# EAGLE design prototype (EAGLE 9.1.3)
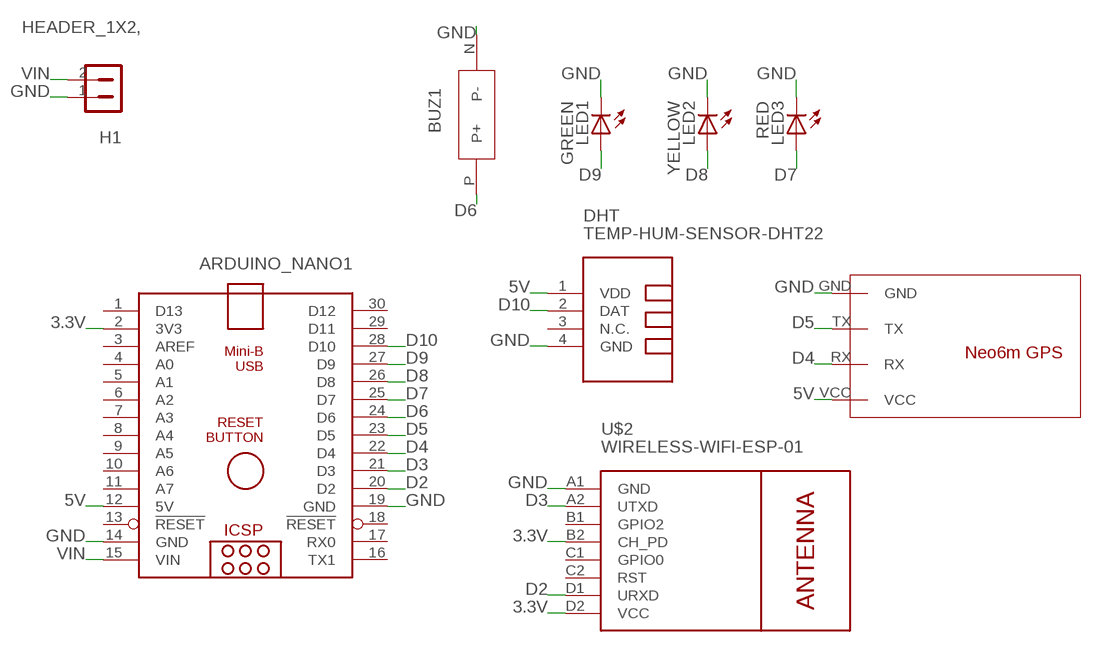
[diagram p0: schematic, sheet 1]

## Parts
ARDUINO_NANO1  ARDUINO_NANO  [ARDUINO_NANO]
BUZ1  BUZZER  [BUZZER]
DHT  TEMP-HUM-SENSOR-DHT22  [TEMP-HUM-SENSOR-DHT22]
H1  HEADER_1X2,  [MA_2X1]
LED1  GREEN  LED5MM  [LED5MM]
LED2  YELLOW  LED5MM  [LED5MM]
LED3  RED  LED5MM  [LED5MM]
U$1  NEO6M  [NEO6M]
U$2  WIRELESS-WIFI-ESP-01  [WIRELESS-WIFI-ESP-01]

## Nets
3.3V: ARDUINO_NANO1.2(3V3) U$2.B2(CH_PD) U$2.D2(VCC)
5V: ARDUINO_NANO1.12(5V) DHT.1(VDD) U$1.VCC
D2: ARDUINO_NANO1.20(D2) U$2.D1(URXD)
D3: ARDUINO_NANO1.21(D3) U$2.A2(UTXD)
D4: ARDUINO_NANO1.22(D4) U$1.RX
D5: ARDUINO_NANO1.23(D5) U$1.TX
D6: ARDUINO_NANO1.24(D6) BUZ1.P(P+)
D7: ARDUINO_NANO1.25(D7) LED3.A
D8: ARDUINO_NANO1.26(D8) LED2.A
D9: ARDUINO_NANO1.27(D9) LED1.A
D10: ARDUINO_NANO1.28(D10) DHT.2(DAT)
GND: ARDUINO_NANO1.14(GND) ARDUINO_NANO1.19(GND) BUZ1.N(P-) DHT.4(GND) H1.1 LED1.K(C) LED2.K(C) LED3.K(C) U$1.GND U$2.A1(GND)
VIN: ARDUINO_NANO1.15(VIN) H1.2
Unconnected: ARDUINO_NANO1.1(D13) ARDUINO_NANO1.3(AREF) ARDUINO_NANO1.4(A0) ARDUINO_NANO1.5(A1) ARDUINO_NANO1.6(A2) ARDUINO_NANO1.7(A3) ARDUINO_NANO1.8(A4) ARDUINO_NANO1.9(A5) ARDUINO_NANO1.10(A6) ARDUINO_NANO1.11(A7) ARDUINO_NANO1.13(!RESET) ARDUINO_NANO1.16(TX1) ARDUINO_NANO1.17(RX0) ARDUINO_NANO1.18(!RESET) ARDUINO_NANO1.29(D11) ARDUINO_NANO1.30(D12) DHT.3(N.C.) U$2.B1(GPIO2) U$2.C1(GPIO0) U$2.C2(RST)

## Library data of the parts
ARDUINO_NANO1 = ArduinoNanoV30:ARDUINO_NANO: Arduino Nano V3.0 Overview: The Arduino Nano is a small, complete, and breadboard-friendly board based on the ATmega328 (Arduino Nano 3.x) or ATmega168 (Arduino Nano 2.x). It has more or less the same functionality of the Arduino Duemilanove, but in a different package. It lacks only a DC power jack, and works with a Mini-B USB cable instead of a standard one. The Nano was designed and is being produced by Gravitech. Specifications: Microcontroller Atmel ATmega168 or ATmega328 Operating Voltage (logic level) 5 V Input Voltage (recommended) 7-12 V Input Voltage (limits) 6-20 V Digital I/O Pins 14 (of which 6 provide PWM output) Analog Input Pins 8 DC Current per I/O Pin 40 mA Flash Memory 16 KB (ATmega168) or 32 KB (ATmega328) of which 2 KB used by bootloader SRAM 1 KB (ATmega168) or 2 KB (ATmega328) EEPROM 512 bytes (ATmega168) or 1 KB (ATmega328) Clock Speed 16 MHz Dimensions 0.73" x 1.70" Length 45 mm Width 18 mm Weigth 5 g Power: The Arduino Nano can be powered via the Mini-B USB connection, 6-20V unregulated external power supply (pin 30), or 5V regulated external power supply (pin 27). The power source is automatically selected to the highest voltage source. Memory: The ATmega168 has 16 KB of flash memory for storing code (of which 2 KB is used for the bootloader); the ATmega328 has 32 KB, (also with 2 KB used for the bootloader). The ATmega168 has 1 KB of SRAM and 512 bytes of EEPROM (which can be read and written with the EEPROM library); the ATmega328 has 2 KB of SRAM and 1 KB of EEPROM. Input and Output: Each of the 14 digital pins on the Nano can be used as an input or output, using pinMode(), digitalWrite(), and digitalRead() functions. They operate at 5 volts. Each pin can provide or receive a maximum of 40 mA and has an internal pull-up resistor (disconnected by default) of 20-50 kOhms. In addition, some pins have specialized functions. Visit Arduino - ArduinoBoardNano <https://www.arduino.cc/en/Main/ArduinoBoardNano>
BUZ1 = solarbiotec:BUZZER: Magnetic Buzzer
DHT = diy-modules:TEMP-HUM-SENSOR-DHT22: DHT22 - digital humidity & temperature sensor Also known as: AM2302 AM2302 datasheet available here: http://akizukidenshi.com/download/ds/aosong/AM2302.pdf Click here to find device on ebay.com <http://www.ebay.com/sch/dht22+digital+sensor>
H1 = solarbiotec:HEADER_1X2: 2 Position Header Connector 0.100" (2.54mm) Through Hole Tin FE_2x1 Datasheet <https://drawings-pdf.s3.amazonaws.com/10492.pdf> Connector Header Through Hole 2 position 0.100" (2.54mm) MA_2x1 Datasheet <https://cdn.harwin.com/pdfs/M20-999.pdf> 2 Position Wire to Board Terminal Block Horizontal with Board 0.100" (2.54mm) Through Hole SCREW_2x1_2.54MM Datasheet <https://www.te.com/commerce/DocumentDelivery/DDEController?Action=srchrtrv&DocNm=1546215&DocType=Customer+Drawing&DocLang=English> 2 Position Terminal Block Plug, Female Sockets 0.400" (10.16mm) 180° Free Hanging (In-Line) SCREW_2x1_10.16MM Datasheet <https://www.te.com/commerce/DocumentDelivery/DDEController?Action=srchrtrv&DocNm=282809&DocType=Customer+Drawing&DocLang=English>; MANUFACTURER_PART_NUMBER: M20-9990246; VENDOR: Harwin Inc.
LED1-LED3 = adafruit:LED: LED OSRAM: - CHIPLED LG R971, LG N971, LY N971, LG Q971, LY Q971, LO R971, LY R971 LH N974, LH R974 LS Q976, LO Q976, LY Q976 LO Q996 - Hyper CHIPLED LW Q18S LB Q993, LB Q99A, LB R99A - SideLED LS A670, LO A670, LY A670, LG A670, LP A670 LB A673, LV A673, LT A673, LW A673 LH A674 LY A675 LS A676, LA A676, LO A676, LY A676, LW A676 LS A679, LY A679, LG A679 - Hyper Micro SIDELED® LS Y876, LA Y876, LO Y876, LY Y876 LT Y87S - SmartLED LW L88C, LW L88S LB L89C, LB L89S, LG L890 LS L89K, LO L89K, LY L89K LS L896, LA L896, LO L896, LY L896 - TOPLED LS T670, LO T670, LY T670, LG T670, LP T670 LSG T670, LSP T670, LSY T670, LOP T670, LYG T670 LG T671, LOG T671, LSG T671 LB T673, LV T673, LT T673, LW T673 LH T674 LS T676, LA T676, LO T676, LY T676, LB T676, LH T676, LSB T676, LW T676 LB T67C, LV T67C, LT T67C, LS T67K, LO T67K, LY T67K, LW E67C LS E67B, LA E67B, LO E67B, LY E67B, LB E67C, LV E67C, LT E67C LW T67C LS T679, LY T679, LG T679 LS T770, LO T770, LY T770, LG T770, LP T770 LB T773, LV T773, LT T773, LW T773 LH T774 LS E675, LA E675, LY E675, LS T675 LS T776, LA T776, LO T776, LY T776, LB T776 LHGB T686 LT T68C, LB T68C - Hyper Mini TOPLED® LB M676 - Mini TOPLED Santana® LG M470 LS M47K, LO M47K, LY M47K Source: http://www.osram.convergy.de/
U$1 = Neo6m_v2:NEO6M
U$2 = diy-modules:WIRELESS-WIFI-ESP-01: Wireless Wi-Fi ESP-01 Module based on ESP8266 chip Click here to find device on ebay.com <http://www.ebay.com/sch/esp8266+esp+01+transceiver>

## Board
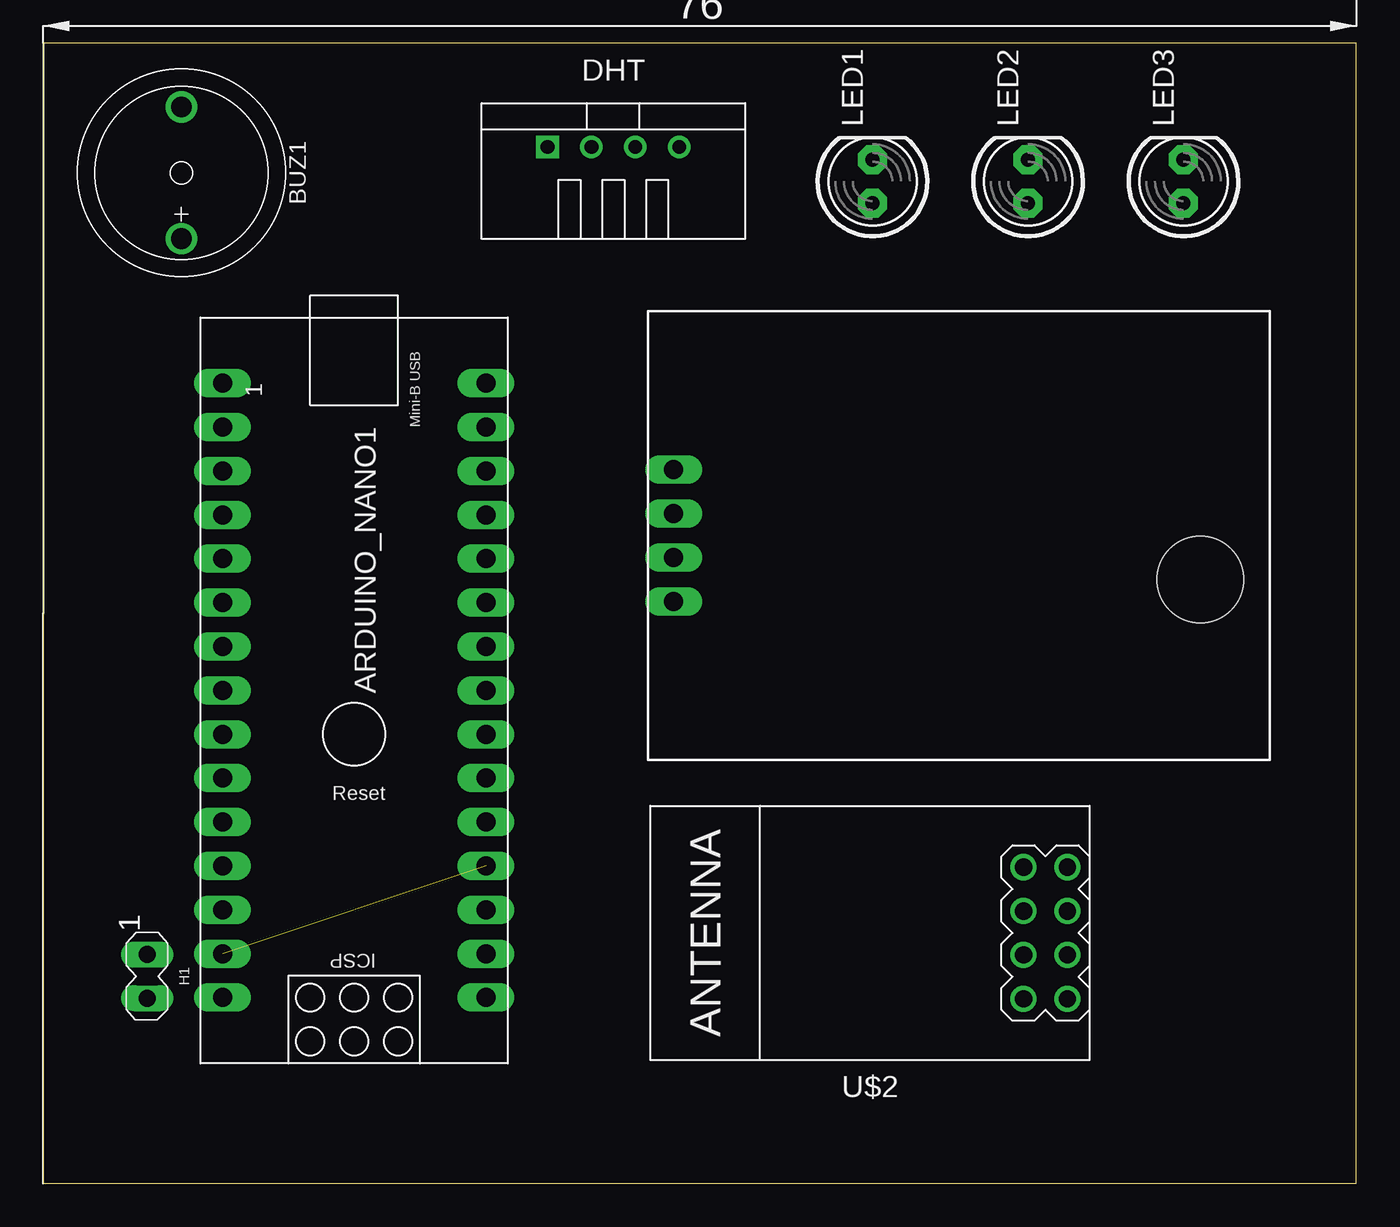
[diagram p1: board, top side]
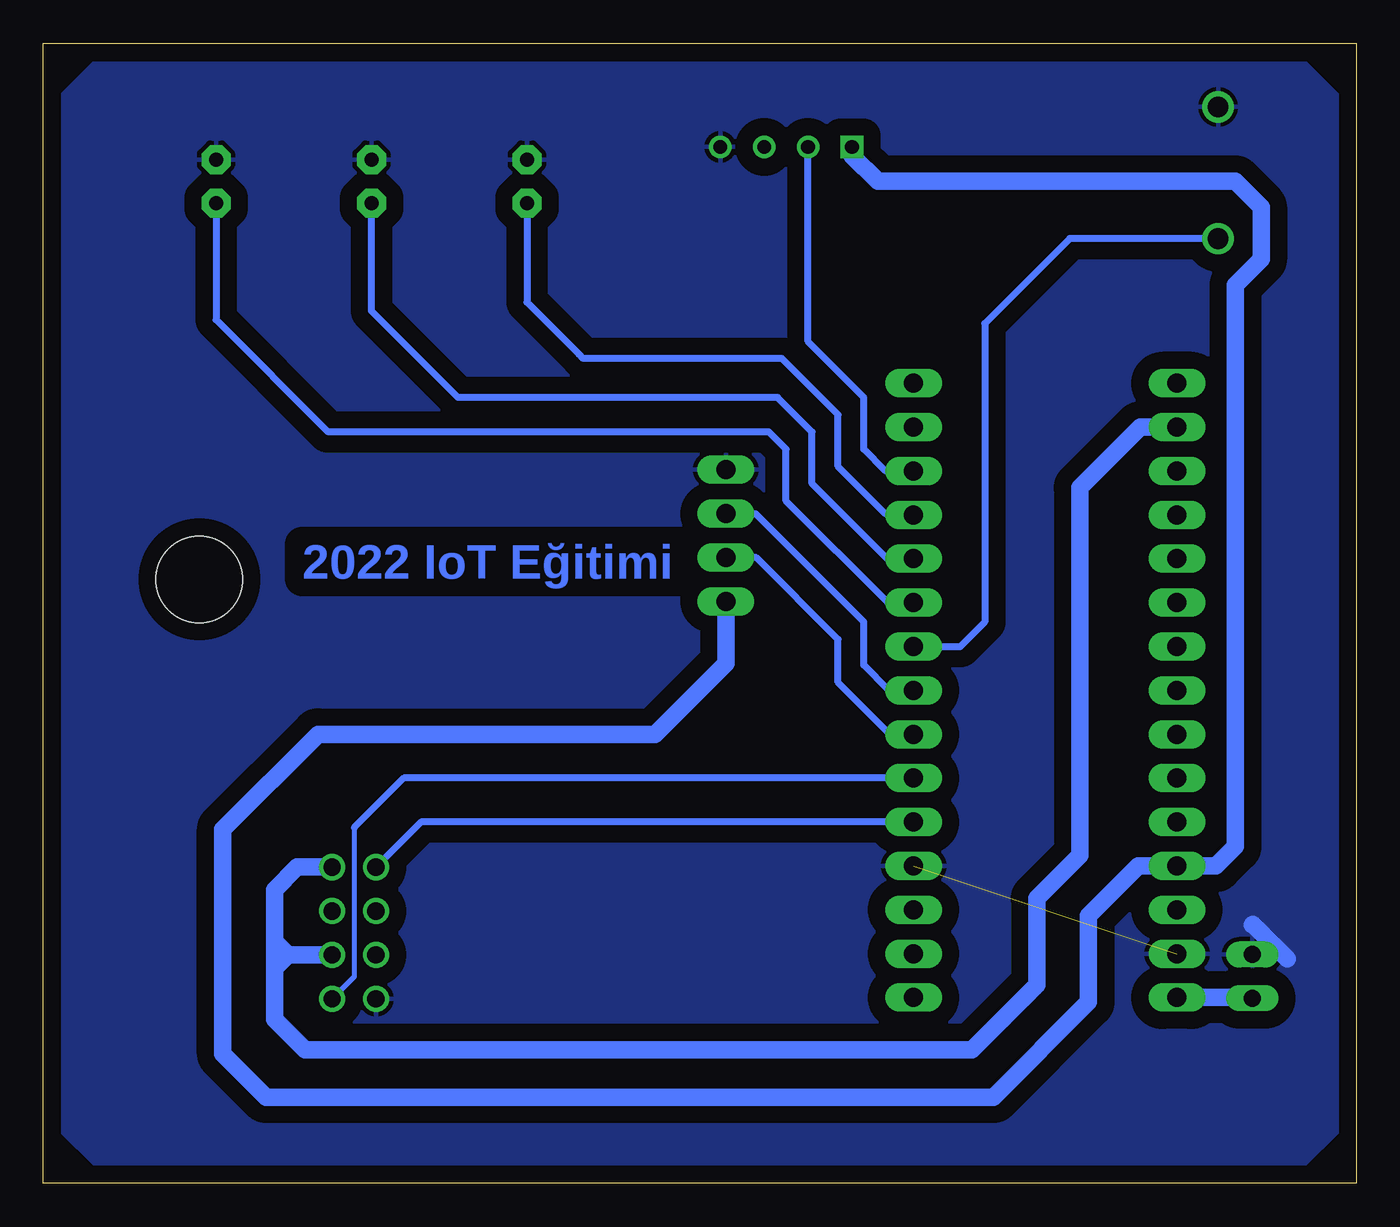
[diagram p2: board, bottom side, seen from below]

Size 76 x 66 mm. Coordinates in mm from the lower left corner, seen from the top.
Outline: 0,0 76,0 76,66 0,66 0,0
Copper layers (1*16): Top 0.035mm / dielectric 1.5mm / Bottom 0.035mm
Design rules "default": minimum track width 6mil, minimum drill 0.35mm, track to track 6mil, track to pad 6mil, pad to pad 6mil, via to via 6mil, smd to smd 6mil, copper to edge 40mil, drill to drill 6mil, minimum pad ring 10mil, minimum via ring 8mil, stop-mask expansion 4mil, vias tented up to drill 0mil, thermal gap 10mil

### Footprints (pad centres in the part's own frame; a part is rotated, then mirrored left to right if it is on the bottom)
ARDUINO_NANO = drill 1.1 pad 1.27 long: 1 -20.32,-7.62; 2 -17.78,-7.62; 3 -15.24,-7.62; 4 -12.7,-7.62; 5 -10.16,-7.62; 6 -7.62,-7.62; 7 -5.08,-7.62; 8 -2.54,-7.62; 9 0,-7.62; 10 2.54,-7.62; 11 5.08,-7.62; 12 7.62,-7.62; 13 10.16,-7.62; 14 12.7,-7.62; 15 15.24,-7.62; 16 15.24,7.62; 17 12.7,7.62; 18 10.16,7.62; 19 7.62,7.62; 20 5.08,7.62; 21 2.54,7.62; 22 0,7.62; 23 -2.54,7.62; 24 -5.08,7.62; 25 -7.62,7.62; 26 -10.16,7.62; 27 -12.7,7.62; 28 -15.24,7.62; 29 -17.78,7.62; 30 -20.32,7.62
BUZZER = drill 1.2: N -3.81,0; P 3.81,0
TEMP-HUM-SENSOR-DHT22 = drill 0.8 square: 1 -3.81,0 | drill 0.8: 2 -1.27,0; 3 1.27,0; 4 3.81,0
MA_2X1 = drill 1 long: 1 -1.26,0.02; 2 1.28,0.02
LED5MM = drill 0.813 pad 1.676 octagon: A -1.27,0; K 1.27,0
NEO6M = drill 1.1 long: GND -16.51,3.81; RX -16.51,-1.27; TX -16.51,1.27; VCC -16.51,-3.81 | hole 5: 13.97,-2.54
WIRELESS-WIFI-ESP-01 = drill 1: A1 -8.89,3.81; A2 -11.43,3.81; B1 -8.89,1.27; B2 -11.43,1.27; C1 -8.89,-1.27; C2 -11.43,-1.27; D1 -8.89,-3.81; D2 -11.43,-3.81

### Placement (x,y rotation side)
ARDUINO_NANO1  18,26 270 top
BUZ1  8,58.5 270 top
DHT  33,60 0 top
H1  6,12 270 top
LED1  48,58 90 top
LED2  57,58 90 top
LED3  66,58 90 top
U$1  53,37.5 0 top
U$2  47.85,14.5 180 top

### Tracks (layer width: path | path; a pad name or v marks a point on that pad's centre or on a via)
3.3V
  Bottom 1: ARDUINO_NANO1.2 12.5,43.78 16,40.28 16,19 18.5,16.5 18.5,11.5 22.25,7.75 60.85,7.75 62.6,9.5 62.6,12 | U$2.D2 61.29,18.31 62.6,17 62.6,15 62.6,14 | 62.6,14 61.83,13.23 | 61.83,13.23 U$2.B2 | 62.6,14 62.6,12 | 61.83,13.23 62.6,12.46 62.6,12
5V
  Bottom 1: U$1.VCC 36.49,30.11 40.6,26 60.1,26 65.6,20.5 65.6,7.5 63.1,5 21,5 15.5,10.5 15.5,15.5 12.62,18.38 ARDUINO_NANO1.12 8.12,18.38 7,19.5 7,52 5.5,53.5 5.5,56.5 7,58 27.69,58 29.19,59.5 DHT.1
D2
  Bottom 0.4: ARDUINO_NANO1.20 54.13,20.92 U$2.D1
D3
  Bottom 0.3: U$2.A2 58,11.97 58,20.6
  Bottom 0.4: ARDUINO_NANO1.21 55.14,23.46 58,20.6
D4
  Bottom 0.4: ARDUINO_NANO1.22 27,26 30,29 30,31.5 34.73,36.23 U$1.RX
D5
  Bottom 0.4: U$1.TX 34.77,38.77 28.5,32.5 28.5,30 27.04,28.54 ARDUINO_NANO1.23
D6
  Bottom 0.4: ARDUINO_NANO1.24 22.92,31.08 21.5,32.5 21.5,49.77 16.58,54.69 BUZ1.P
D7
  Bottom 0.4: ARDUINO_NANO1.25 27.12,33.62 33,39.5 33,42.5 34,43.5 59.5,43.5 66,50 LED3.A
D8
  Bottom 0.4: ARDUINO_NANO1.26 27.16,36.16 31.5,40.5 31.5,43.5 33.5,45.5 52,45.5 57,50.5 57,56.5
  Bottom 0.5: 57,56.5 LED2.A
D9
  Bottom 0.4: LED1.A 48,51 45,48 | 45,48 44.75,47.75 | 44.75,47.75 33.25,47.75 30,44.5 30,41.5 27.25,38.75 25.67,38.75 ARDUINO_NANO1.27 | 44.75,47.75 45,48
D10
  Bottom 0.4: ARDUINO_NANO1.28 27.24,41.24 28.5,42.5 28.5,45.5 31.73,48.73 DHT.2
GND  (1 unrouted)
  Bottom 1: 10.34,13.26 ARDUINO_NANO1.14 | 6.02,14.98 6,15 4,13 4.26,13.26 | H1.1 6.26,13.26
  pour Bottom (isolate 1, rank 2): 1,63 3,65 73,65 75,63 75,3 73,1 3,1 1,3
VIN
  Bottom 1: H1.2 6.06,10.76 ARDUINO_NANO1.15

### Text on the board
Bottom: 2022 IoT Eğitimi